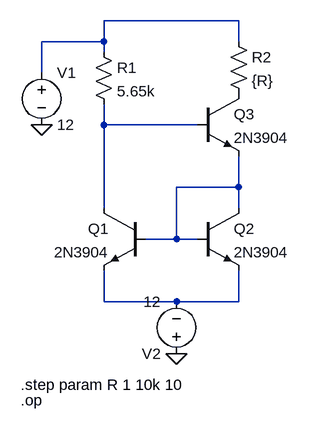
[diagram p0: schematic fuenteWilson.asc]
fuenteWilson.asc, the LTspice schematic file:
Version 4
SHEET 1 1184 680
WIRE 624 -304 416 -304
WIRE 416 -272 416 -304
WIRE 416 -272 320 -272
WIRE 624 -272 624 -304
WIRE 416 -256 416 -272
WIRE 320 -224 320 -272
WIRE 416 -144 416 -176
WIRE 560 -144 416 -144
WIRE 624 -48 624 -96
WIRE 624 -48 528 -48
WIRE 416 -16 416 -144
WIRE 624 -16 624 -48
WIRE 528 32 528 -48
WIRE 528 32 480 32
WIRE 560 32 528 32
WIRE 416 128 416 80
WIRE 528 128 416 128
WIRE 624 128 624 80
WIRE 624 128 528 128
FLAG 320 -144 0
FLAG 528 208 0
SYMBOL npn 480 -16 M0
SYMATTR InstName Q1
SYMATTR Value 2N3904
SYMBOL npn 560 -16 R0
SYMATTR InstName Q2
SYMATTR Value 2N3904
SYMBOL npn 560 -192 R0
SYMATTR InstName Q3
SYMATTR Value 2N3904
SYMBOL res 400 -272 R0
SYMATTR InstName R1
SYMATTR Value 5.65k
SYMBOL voltage 320 -240 R0
WINDOW 123 0 0 Left 2
WINDOW 39 0 0 Left 2
SYMATTR InstName V1
SYMATTR Value 12
SYMBOL res 608 -288 R0
SYMATTR InstName R2
SYMATTR Value {R}
SYMBOL voltage 528 224 R180
WINDOW 123 0 0 Left 2
WINDOW 39 0 0 Left 2
SYMATTR InstName V2
SYMATTR Value 12
TEXT 288 256 Left 2 !.step param R 1 10k 10
TEXT 288 280 Left 2 !.op

The netlist it stands for:
* fuenteWilson.asc
Q1 N002 N003 N004 0 2N3904
Q2 N003 N003 N004 0 2N3904
Q3 P001 N002 N003 0 2N3904
R1 N001 N002 5.65k
V1 N001 0 12
R2 N001 P001 {R}
V2 0 N004 12
.model NPN NPN
.model PNP PNP
.lib standard.bjt
.step param R 1 10k 10
.op
.backanno
.end